# EAGLE design tempLogger Arduino (EAGLE 8.0.1)
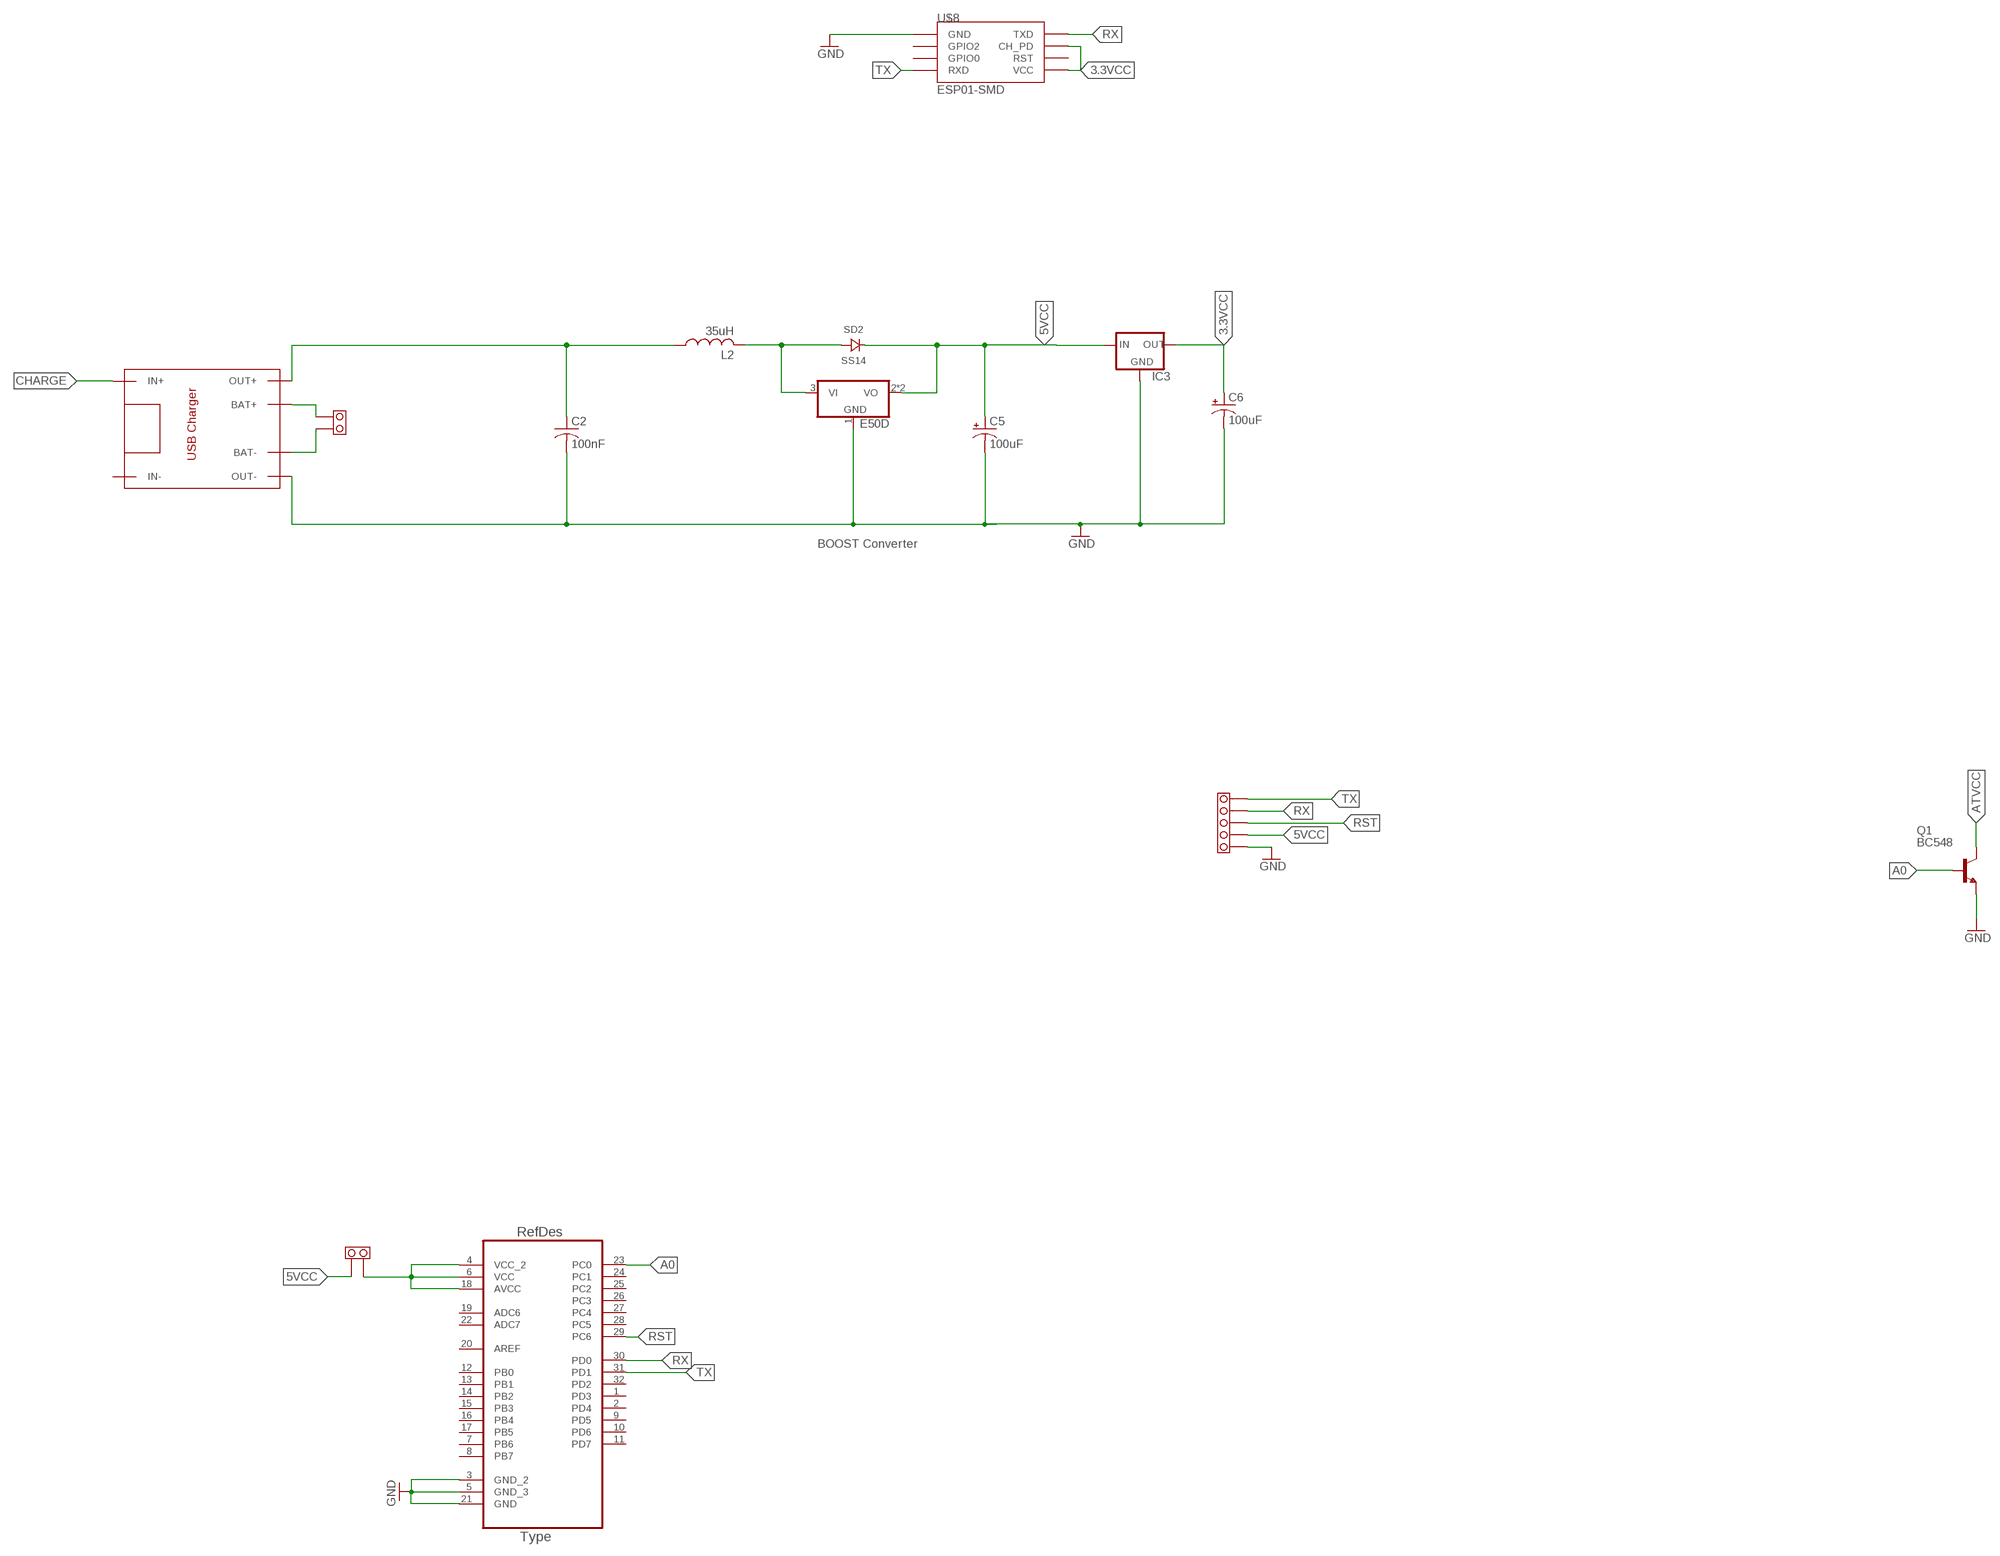
[diagram p0: schematic, sheet 1]

## Parts
C2  100nF  C-USC1206  [C1206]
C5  100uF  CPOL-US150CLZ-0810  [150CLZ-0810]
C6  100uF  CPOL-US153CLV-0405  [153CLV-0405]
IC2  E50D  [SOT89]
IC3  LM1117  [SOT223]
L2  35uH  L-USWE-TPC  [POWER-CHOKE_WE-TPC]
Q1  BC548  [TO92-EBC]
SD2  SS14  [DO214]
U1  ATMEGA328P-AU  [QFP80P900X900X120-32N]
U$2  TP4056  [TP4056]
U$3  BERG_5  [BERG_5]
U$4  BERG_2  [BERG_2]
U$5  BERG_2  [BERG_2]
U$8  ESP01-SMD  [ESP01_SMD]

## Nets
3.3VCC: C6.+ IC3.2(OUT) U$8.CH_PD U$8.VCC
5VCC: C5.+ IC2.2(VO) IC2.2@1(VO) IC3.3(IN) SD2.CATHODE U$3.H U$5.F
A0: Q1.B U1.23(PC0)
ATVCC: Q1.C U1.4(VCC_2) U1.6(VCC) U1.18(AVCC) U$5.E
CHARGE: U$2.IN+
GND: C2.2 C5.- C6.- IC2.1(GND) IC3.1(GND) Q1.E U1.3(GND_2) U1.5(GND_3) U1.21(GND) U$2.OUT- U$3.I U$8.GND
N$1: IC2.3(VI) L2.2 SD2.ANODE
N$3: U$2.BAT+ U$4.F
N$4: U$2.BAT- U$4.E
N$6: C2.1 L2.1 U$2.OUT+
RST: U1.29(PC6) U$3.G
RX: U1.30(PD0) U$3.F U$8.TX(TXD)
TX: U1.31(PD1) U$3.E U$8.RX(RXD)
Unconnected: U1.1(PD3) U1.2(PD4) U1.7(PB6) U1.8(PB7) U1.9(PD5) U1.10(PD6) U1.11(PD7) U1.12(PB0) U1.13(PB1) U1.14(PB2) U1.15(PB3) U1.16(PB4) U1.17(PB5) U1.19(ADC6) U1.20(AREF) U1.22(ADC7) U1.24(PC1) U1.25(PC2) U1.26(PC3) U1.27(PC4) U1.28(PC5) U1.32(PD2) U$2.IN- U$8.GPIO0 U$8.GPIO2 U$8.RST

## Notes on the sheet
- BOOST Converter

## Library data of the parts
C2 = rcl:C-US: CAPACITOR, American symbol
C5 C6 = rcl:CPOL-US: POLARIZED CAPACITOR, American symbol
IC2 = dragCustom:E50D
IC3 = v-reg-3:LM1117
L2 = rcl:L-US: INDUCTOR, American symbol
Q1 = transistor-npn:BC548*: NPN Transistor
SD2 = ihpcb-diode:SS14
U1 = ATmega328-AU:ATMEGA328P-AU; DESCRIPTION: 8-bit Microcontroller with In-System Programmable Flash; MPN: ATMEGA328P-AU; OC_FARNELL: 1715486; OC_NEWARK: 14R4631; PACKAGE: TQFP-32; SUPPLIER: Atmel
U$2 = TP4056 charging module:TP4056
U$3 = dragCustom:BERG_5
U$4 U$5 = dragCustom:BERG_2
U$8 = ESP8266Modules:ESP01-SMD

## Board
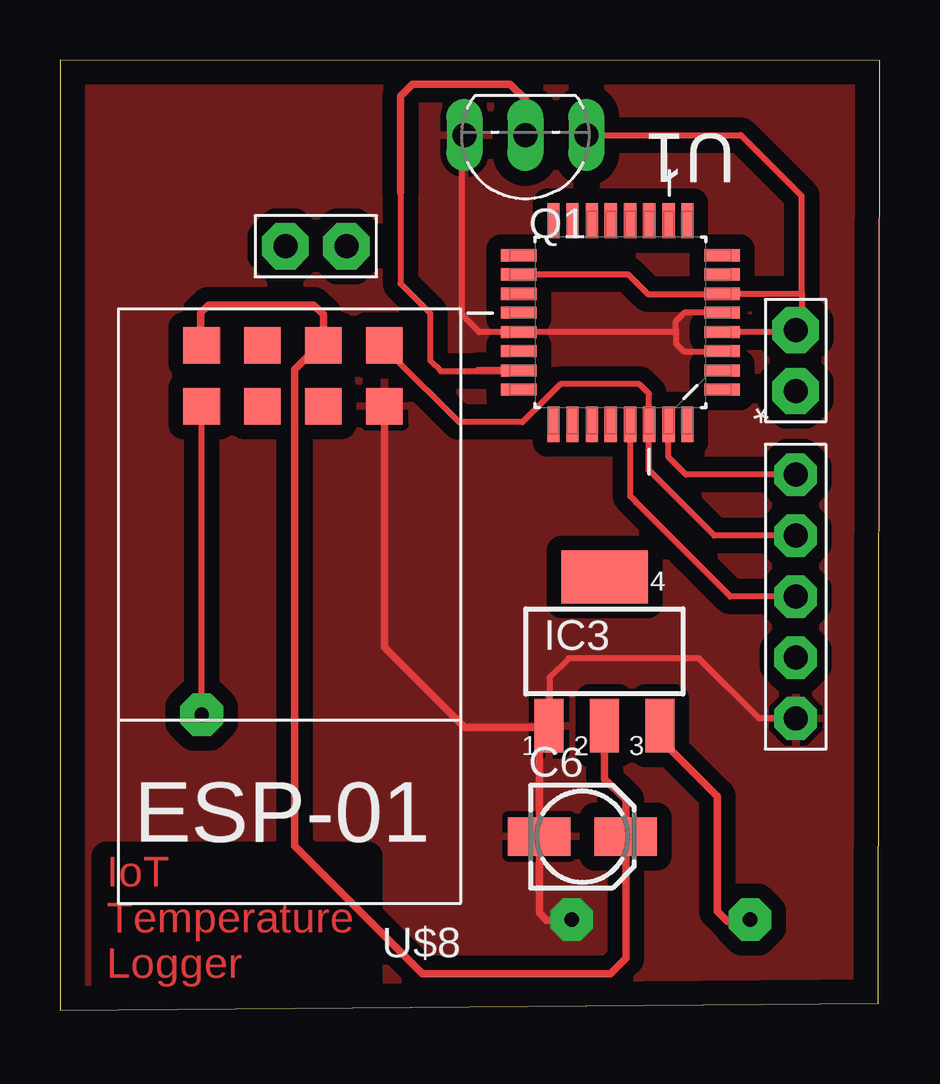
[diagram p1: board, top side]
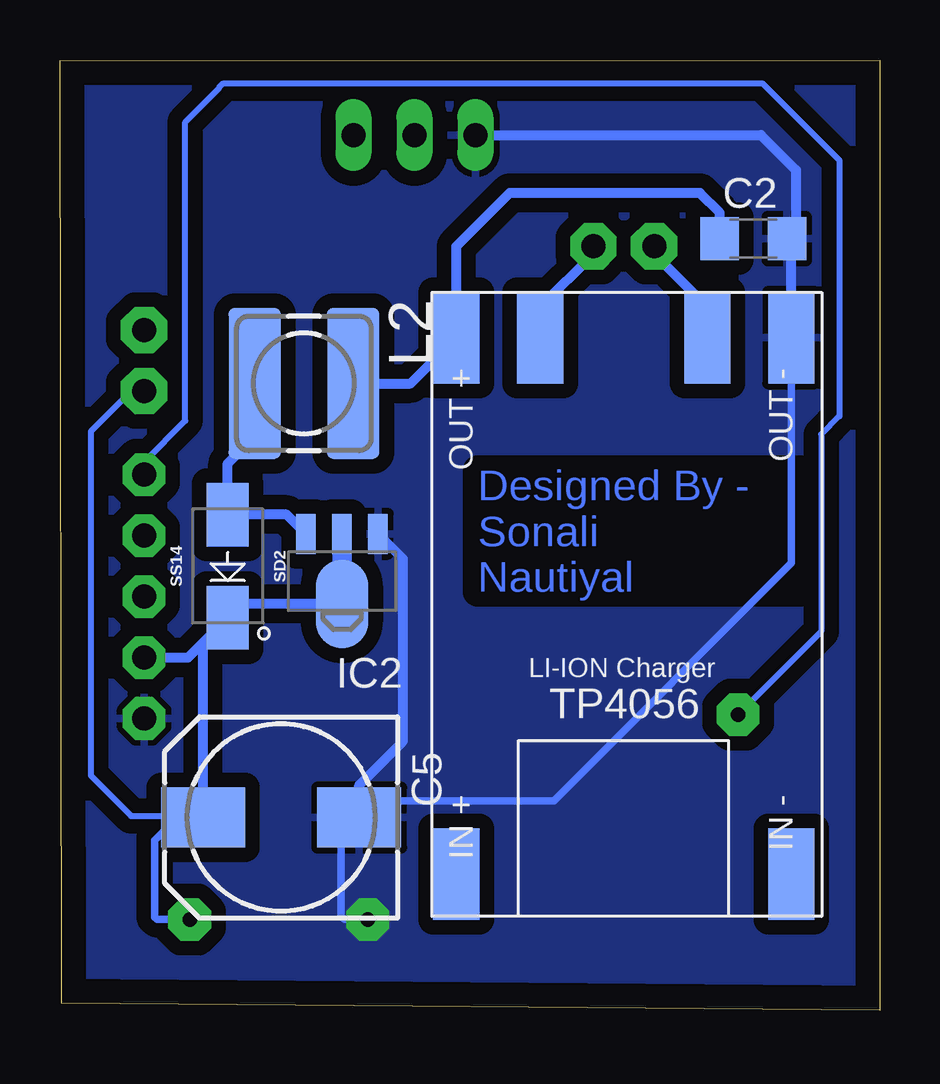
[diagram p2: board, bottom side, seen from below]

Size 34.17 x 39.61 mm. Coordinates in mm from the lower left corner, seen from the top.
Outline: 0,0 34.11,0.29 34.17,39.58 0,39.61 0,0
Copper layers (1*16): Top 0.035mm / dielectric 1.5mm / Bottom 0.035mm
Design rules "default": minimum track width 10mil, minimum drill 24mil, track to track 8mil, track to pad 8mil, pad to pad 8mil, via to via 8mil, smd to smd 8mil, copper to edge 40mil, drill to drill 8mil, minimum pad ring 10mil, minimum via ring 8mil, stop-mask expansion 4mil, vias tented up to drill 0mil, thermal gap 10mil

### Footprints (pad centres in the part's own frame; a part is rotated, then mirrored left to right if it is on the bottom)
C1206 = smd 1.6 x 1.8: 1 -1.4,0; 2 1.4,0
150CLZ-0810 = smd 3.5 x 2.5: + 3.25,0; - -3.25,0
153CLV-0405 = smd 2.6 x 1.6: + 1.8,0; - -1.8,0
SOT89 = smd 0.813 x 1.676: 1 -1.499,-1.981; 2 0,-1.981; 3 1.499,-1.981 | smd 2.2 x 3.7: 2@1 0,0.94
SOT223 = smd 1.219 x 2.235: 1 -2.311,-3.099; 2 0,-3.099; 3 2.311,-3.099 | smd 3.6 x 2.2: 4 0,3.099
POWER-CHOKE_WE-TPC = smd 6.3 x 2.2: 1 0,2.05; 2 0,-2.05
TO92-EBC = drill 1 long: B 0,-1.27; C -2.54,-1.27; E 2.54,-1.27
DO214 = smd 2.65 x 1.75: ANODE -2.15,0; CATHODE 2.15,0
QFP80P900X900X120-32N = smd 1.473 x 0.508: 1 -4.242,2.794; 2 -4.242,2.007; 3 -4.242,1.194; 4 -4.242,0.406; 5 -4.242,-0.406; 6 -4.242,-1.194; 7 -4.242,-2.007; 8 -4.242,-2.794; 17 4.242,-2.794; 18 4.242,-2.007; 19 4.242,-1.194; 20 4.242,-0.406; 21 4.242,0.406; 22 4.242,1.194; 23 4.242,2.007; 24 4.242,2.794 | smd 0.508 x 1.473: 9 -2.794,-4.242; 10 -2.007,-4.242; 11 -1.194,-4.242; 12 -0.406,-4.242; 13 0.406,-4.242; 14 1.194,-4.242; 15 2.007,-4.242; 16 2.794,-4.242; 25 2.794,4.242; 26 2.007,4.242; 27 1.194,4.242; 28 0.406,4.242; 29 -0.406,4.242; 30 -1.194,4.242; 31 -2.007,4.242; 32 -2.794,4.242
TP4056 = smd 1.93 x 3.81: BAT+ 5.39,-10.16; BAT- -1.58,-10.16; IN+ 8.89,12.2; IN- -5.08,12.2; OUT+ 8.89,-10.16; OUT- -5.08,-10.16
BERG_5 = drill 1 pad 1.778 octagon: E 0,5.08; F 0,2.54; G 0,0; H 0,-2.54; I 0,-5.08
BERG_2 = drill 1 pad 1.93 octagon: E 0,2.54; F 0,0
ESP01_SMD = smd 1.524 x 1.524: CH_PD -1.27,-8.255; GND -3.81,-5.715; GPIO0 1.27,-5.715; GPIO2 -1.27,-5.715; RST 1.27,-8.255; RX 3.81,-5.715; TX -3.81,-8.255; VCC 3.81,-8.255

### Placement (x,y rotation side)
C2  5.27,32.16 0 bottom
C5  24.96,8.03 180 bottom
C6  21.78,7.24 0 top
IC2  22.42,17.88 180 bottom
IC3  22.7,14.95 0 top
L2  24,26.13 270 bottom
Q1  19.4,35.21 180 top
SD2  27.18,18.51 270 bottom
U1  23.37,28.67 180 top
U$2  8.76,17.88 180 bottom
U$3  30.67,17.24 0 top
U$4  11.94,31.85 90 top
U$5  30.67,25.81 0 top
U$8  9.72,19.46 180 top

### Tracks (layer width: path | path; a pad name or v marks a point on that pad's centre or on a via)
3.3VCC
  Top 0.305: IC3.2 22.7,9.65 23.59,8.76 C6.+ 23.59,7.23 23.59,3.33 | U$8.VCC 5.87,27.75 5.87,29.08 6.19,29.4 10.57,29.4 10.99,28.99 U$8.CH_PD 10.79,27.72 9.78,26.7 9.78,6.86 15.11,1.52 22.96,1.52 23.59,2.16 23.59,3.33 | 23.59,3.08 23.59,3.33
5VCC  (via drill 0.6 pad 1.78)
  Top 0.305: IC3.3 25.01,11.31 27.4,8.92 27.4,4.13 27.81,3.71 28.35,3.71 28.38,3.75 28.73,3.75 v28.77,3.78
  Bottom 0.254: U$5.F 31.21,25.81 32.89,24.13 32.89,9.78 31.21,8.1 28.27,8.1 C5.+
  Bottom 0.305: C5.+ 28.36,7.87 29.43,7.87 30.23,7.08 30.23,3.87 30.13,3.78 v28.77,3.78
  Bottom 0.406: IC2.2 IC2.2@1 26.6,16.93 SD2.CATHODE 27.52,16.02 | C5.+ 28.21,15.33 27.52,16.02 | U$3.H 28.84,14.7 27.52,16.02
A0
  Top 0.254: 14.19,34.1 14.19,30.29 15.43,29.05 15.43,27.08 15.88,26.64 17.41,26.64 17.44,26.66
  Top 0.305: 17.44,26.66 U1.23 | 14.19,34.1 14.19,38.1 14.7,38.61 18.76,38.61 19.4,37.97 Q1.B
ATVCC
  Top 0.254: Q1.C 28.38,36.48 30.93,33.94 30.93,29.94 | 30.93,29.94 30.93,28.61 U$5.E | U1.4 30.58,28.26 U$5.E | 30.93,29.94 30.85,29.86 U1.6 27.59,29.84 24.51,29.84 23.68,30.68 U1.18 | U$5.E 31.37,28.35
GND  (via drill 0.6 pad 1.78)
  Top 0.254: U1.5 26.03,29.08 25.69,28.73 25.69,28.38 | 25.69,28.38 25.69,27.78 26,27.46 27.6,27.46 U1.3 | 25.69,28.38 25.57,28.26 U1.21 17.49,28.26 16.76,28.99 16.76,36.39 Q1.E | U$3.I 29.15,12.16 26.64,14.67 21.21,14.67 20.41,13.87 20.41,11.88 IC3.1
  Top 0.305: U$8.GND 13.53,15.11 16.86,11.78 20.31,11.78 IC3.1 19.98,11.45 C6.- 19.98,4.05 20.29,3.75 21.3,3.75 v21.34,3.78
  Bottom 0.305: v21.34,3.78 22.32,3.78 22.45,3.91 22.45,7.29 C5.- 21.01,8.73 13.59,8.73 3.68,18.64 U$2.OUT-
  Bottom 0.406: C5.- 21.71,9.38 19.88,11.21 19.88,18.82 IC2.1 | 3.37,28.67 3.37,28.35 U$2.OUT- 3.68,31.98 C2.2 3.49,32.54 3.49,35.02 4.95,36.48 Q1.E
  pour Top (isolate 0.61): -0.13,39.78 34.16,39.78 34.16,0.41 -0.13,0.41
  pour Bottom (isolate 0.61): -0.13,39.78 34.16,39.78 34.16,0.41 -0.13,0.41
N$1
  Bottom 0.406: SD2.ANODE 24.72,20.66 IC2.3 | 27.2,20.69 SD2.ANODE | SD2.ANODE 27.18,22.8 26.07,23.91 26.07,26.12 L2.2
N$3
  Bottom 0.406: U$4.F 11.94,31.53 14.16,29.3 U$2.BAT+
N$4
  Bottom 0.406: U$4.E 9.4,31.53 7.49,29.62 7.49,28.34 U$2.BAT-
N$6
  Bottom 0.406: C2.1 6.67,33.25 7.49,34.07 15.43,34.07 17.65,31.84 U$2.OUT+ 19.56,26.13 L2.1
RST
  Top 0.254: U$3.G 27.94,17.24 24,21.18 24,21.21 23.78,21.43 U1.29
RX
  Top 0.254: U$3.F 27.27,19.78 24.54,22.51 24.54,24.41 U1.30 24.56,25.7 24.16,26.1 20.86,26.1 19.27,24.51 16.64,24.51 13.88,27.27 13.88,27.37 U$8.TX
TX  (via drill 0.6 pad 1.78)
  Top 0.254: U$3.E 26.1,22.32 25.37,23.05 U1.31 | v5.91,12.32 U$8.RX
  Bottom 0.254: U$3.E 30.67,22.86 28.96,24.57 28.96,37.02 27.56,38.42 27.56,38.45 27.37,38.64 4.89,38.64 2.1,35.85 1.68,35.43 1.68,24.76 2.45,24 2.45,15.78 v5.91,12.32

### Text on the board
Top: IoT / Temperature / Logger
Bottom: Designed By - / Sonali / Nautiyal